# EAGLE design reload (EAGLE 6.2)
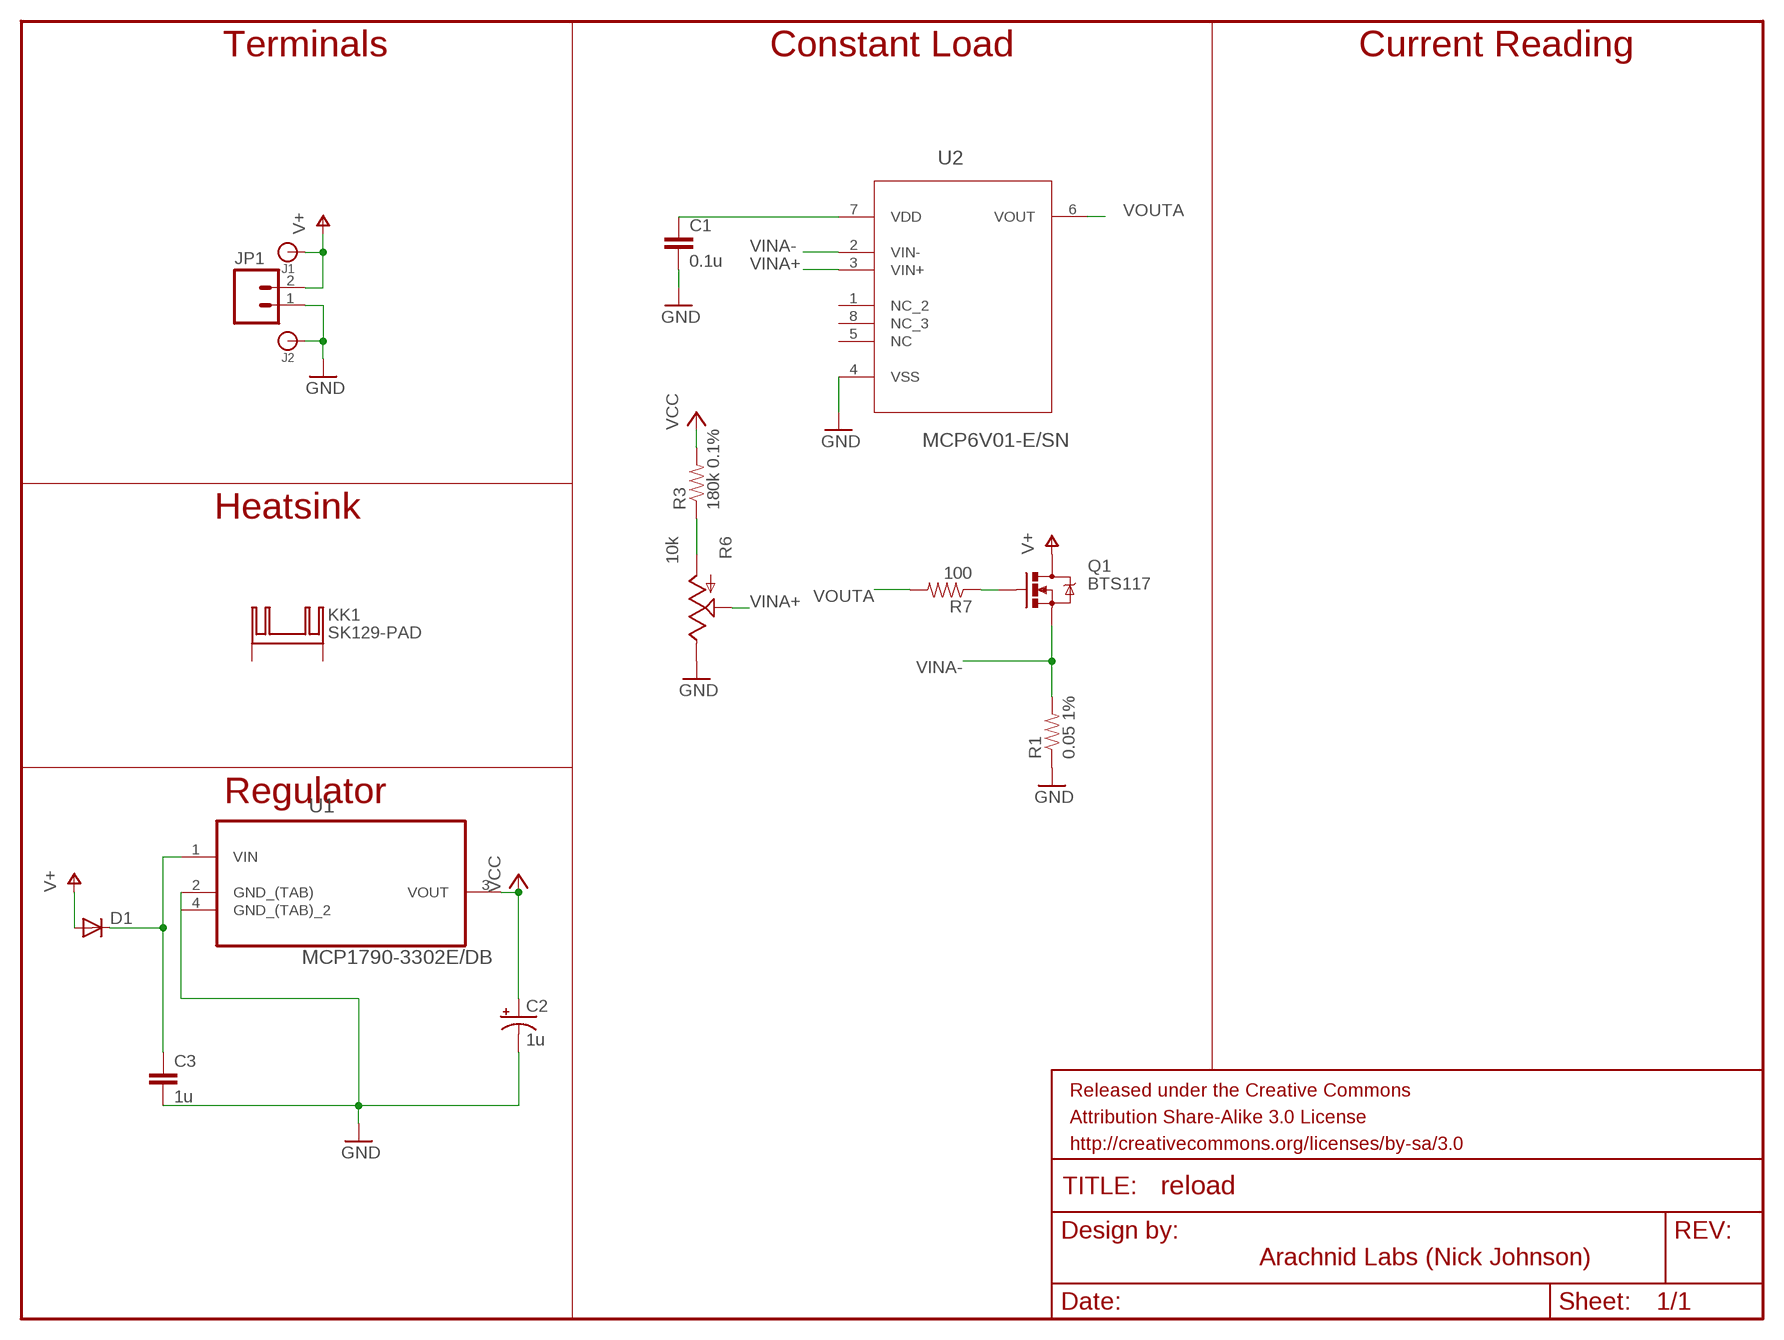
[diagram p0: schematic, sheet 1]

## Parts
C1  0.1u  CAPPTH  [CAP-PTH-SMALL]
C2  1u  CAP_POLPTH2  [CPOL-RADIAL-10UF-25V]
C3  1u  CAPPTH1  [CAP-PTH-5MM]
D1  DIODE1N4148  [DIODE-1N4148]
J1  BANANA_CONN  [BANANA_CONN]
J2  BANANA_CONN  [BANANA_CONN]
JP1  M02  [SPRINGTERMINAL-5MM-2]
KK1  SK129-PAD  [SK129]
Q1  BTS117  MOSFET-NCHANNELPTH2  [TO220V]
R1  0.05 1%  RESISTORPTH-1W  [AXIAL-0.6]
R3  180k 0.1%  RESISTORAXIAL-0.3  [AXIAL-0.3]
R6  10k  POT  [ALPS_POT]
R7  100  RESISTORAXIAL-0.3  [AXIAL-0.3]
U1  MCP1790-3302E/DB  [SOT230P700X180-4N]
U2  MCP6V01-E/SN  [SOIC127P600X175-8N]

## Nets
GND: C1.2 C2.2(-) C3.2 J2.P$1 JP1.1 R1.P$1 R6.P$1(E) U1.2(GND_(TAB)) U1.4(GND_(TAB)_2) U2.4(VSS)
N$2: R3.P$1 R6.P$3(A)
N$3: C1.1 U2.7(VDD)
N$8: C3.1 D1.C U1.1(VIN)
N$9: Q1.1(G) R7.P$1
V+: D1.A J1.P$1 JP1.2 Q1.2(D)
VCC: C2.1(+) R3.P$2
VINA+: R6.P$2(S) U2.3(VIN+)
VINA-: Q1.3(S) R1.P$2 U2.2(VIN-)
VOUTA: R7.P$2 U2.6(VOUT)
Unconnected: KK1.A2,5(K) KK1.B2,5(K) U1.3(VOUT) U2.1(NC_2) U2.5(NC) U2.8(NC_3)

## Notes on the sheet
- Terminals | Constant Load | Current Reading
- Heatsink
- Regulator
- Arachnid Labs (Nick Johnson)

## Library data of the parts
C1 C3 = SparkFun-Passives:CAP: Capacitor Standard 0603 ceramic capacitor, and 0.1" leaded capacitor.
C2 = SparkFun-Passives:CAP_POL: Capacitor Polarized These are standard SMD and PTH capacitors. Normally 10uF, 47uF, and 100uF in electrolytic and tantalum varieties. Always verify the external diameter of the through hole cap, it varies with capacity, voltage, and manufacturer. The EIA devices should be standard.
D1 = SparkFun-DiscreteSemi:DIODE: Diode These are standard reverse protection diodes and small signal diodes. SMA package can handle up to about 1A. SOD-323 can handle about 200mA. What the SOD-323 package when ordering, there are some mfgs out there that are 5-pin packages.
J1 J2 = SparkFun-Connectors:BANANA_CONN: Through-hole banana jack
JP1 = nickparts:M02: Header 2 Standard 2-pin 0.1" header. Use with straight break away headers (SKU : PRT-00116), right angle break away headers (PRT-00553), swiss pins (PRT-00743), machine pins (PRT-00117), and female headers (PRT-00115). Molex polarized connector foot print use with SKU : PRT-08233 with associated crimp pins and housings.
KK1 = nickparts:SK129-PAD: HEATSINK manufacturer Fischer/distributor Buerklin
Q1 = SparkFun-DiscreteSemi:MOSFET-NCHANNEL: Generic NMOS footprint
R1 R3 R7 = SparkFun-Passives:RESISTOR: Resistor Basic schematic elements and footprints for 0603, 1206, and PTH resistors.
R6 = nickparts:POT
U1 = Microchip_By_element14_Batch_1:MCP1790-3302E/DB: IC, LDO VOLT REG, 3.3V, 70mA; MPN: MCP1790-3302E/DB; OC_FARNELL: 1675422; OC_NEWARK: 40M0645; PACKAGE: SOT-223-3; SUPPLIER: Microchip
U2 = Microchip_By_element14_Batch_1:MCP6V01-E/SN: Auto-Zeroed Op Amps; MPN: MCP6V01-E/SN; OC_FARNELL: 1629346; OC_NEWARK: 27M0220; PACKAGE: SOIC-8; SUPPLIER: Microchip

## Board
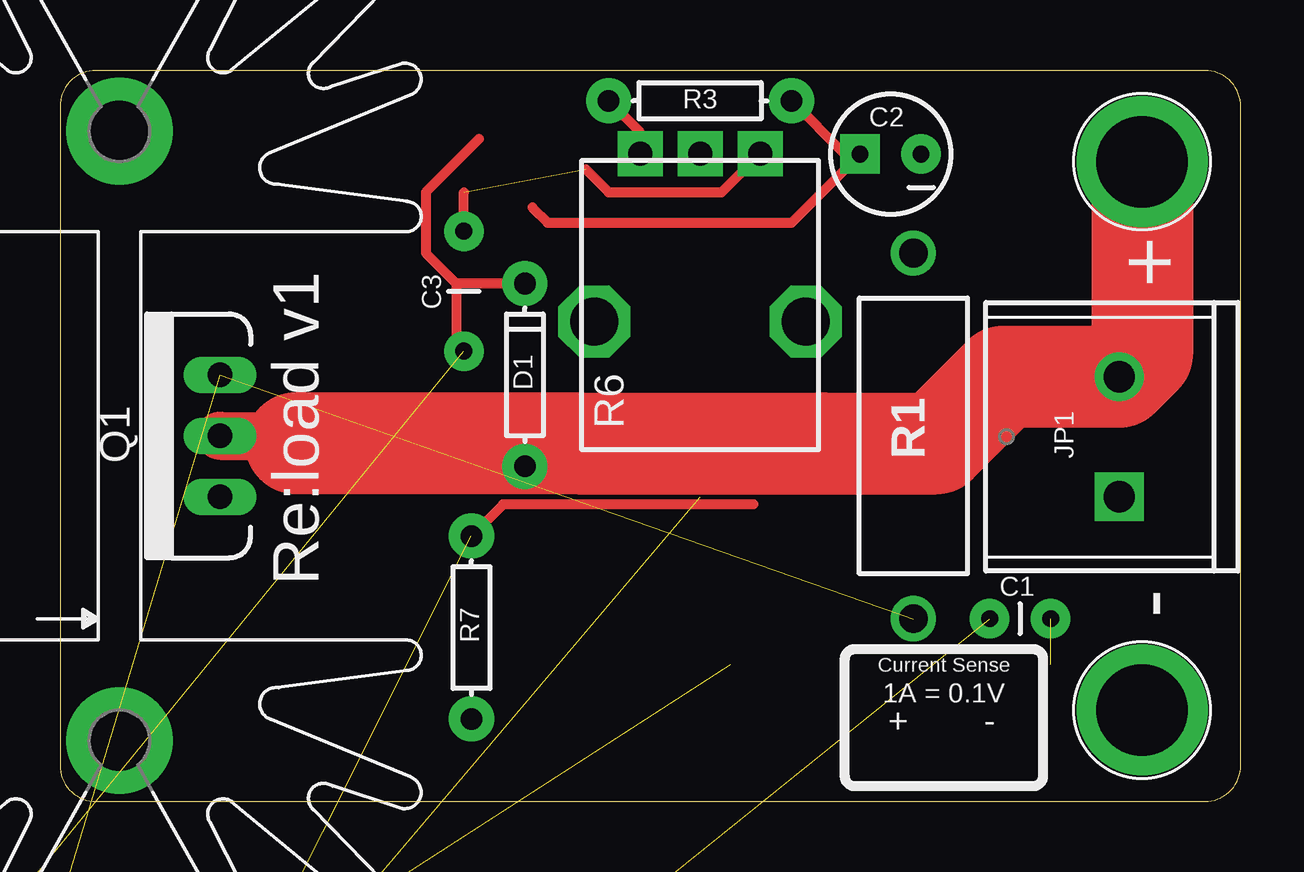
[diagram p1: board, top side]
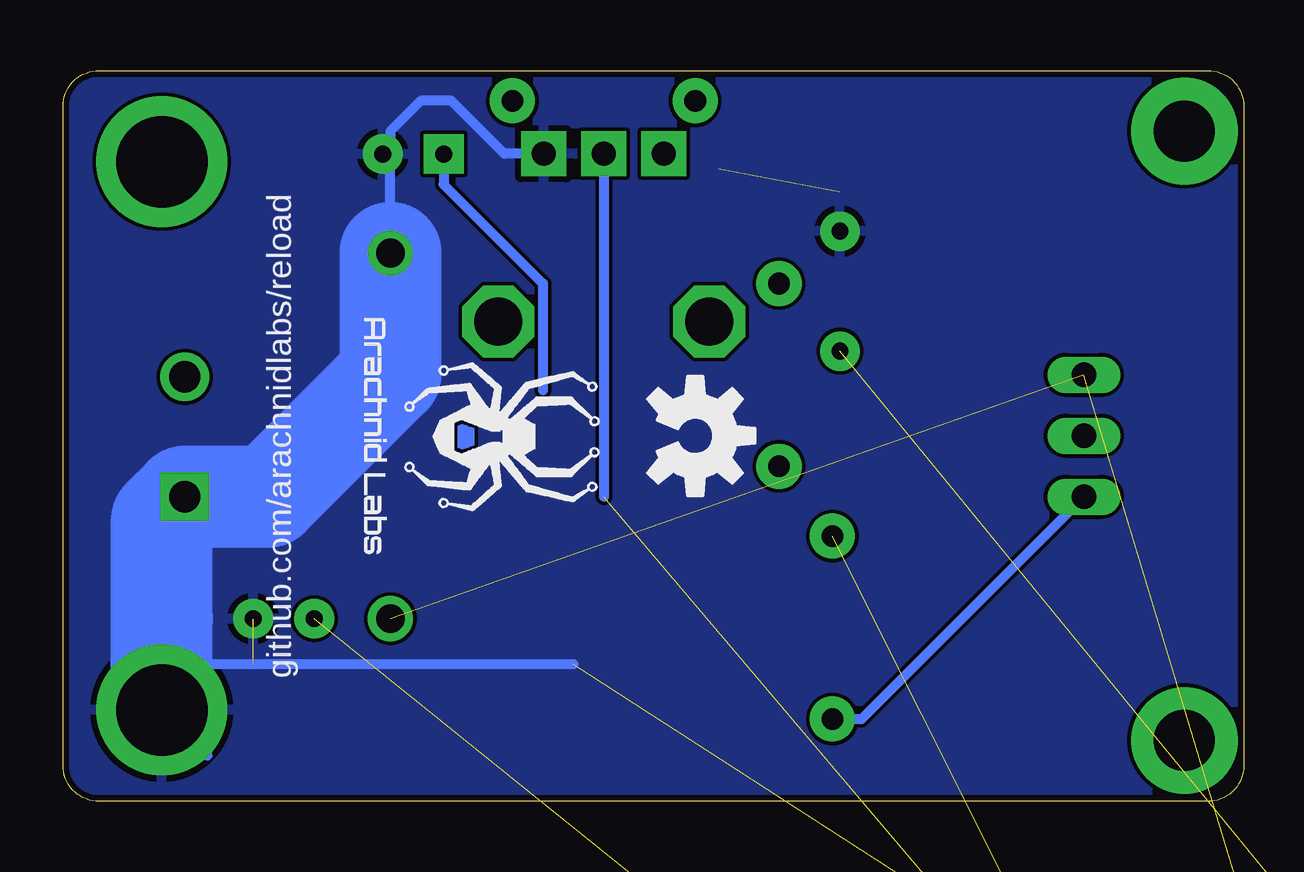
[diagram p2: board, bottom side, seen from below]

Size 49.2 x 30.47 mm. Coordinates in mm from the lower left corner, seen from the top.
Outline: 0,28.97 0,1.5 arc90 1.5,0 47.7,0 arc90 49.2,1.5 49.2,28.97 arc90 47.7,30.47 1.5,30.47 arc90 0,28.97
Copper layers (1*16): Top 0.035mm / dielectric 1.5mm / Bottom 0.035mm
Design rules: minimum track width 6mil, minimum drill 0.3mm, track to track 6mil, track to pad 6mil, pad to pad 6mil, via to via 6mil, smd to smd 0mil, copper to edge 10mil, drill to drill 10mil, minimum pad ring 10mil, minimum via ring 6mil, stop-mask expansion 2mil, vias tented up to drill 100mil, thermal gap 10mil

### Footprints (pad centres in the part's own frame; a part is rotated, then mirrored left to right if it is on the bottom)
CAP-PTH-SMALL = drill 0.7 pad 1.651: 1 0,0; 2 2.54,0
CPOL-RADIAL-10UF-25V = drill 0.7 pad 1.651 square: 1 1.27,0 | drill 0.7 pad 1.651: 2 -1.27,0
CAP-PTH-5MM = drill 0.7 pad 1.651: 1 -2.5,0; 2 2.5,0
DIODE-1N4148 = drill 0.9 pad 1.88: A -3.81,0; C 3.81,0
BANANA_CONN = drill 3.81 pad 5.461: P$1 0,0
SPRINGTERMINAL-5MM-2 = drill 1.3 pad 2.032 square: 1 0,0 | drill 1.3 pad 2.032: 2 5,0
SK129 = drill 2.54 pad 4.445: A2,5 -12.7,-0.889; B2,5 12.7,-0.889
TO220V = drill 1.016 long: 1 -2.54,0; 2 0,0; 3 2.54,0
AXIAL-0.6 = drill 1.2 pad 1.88: P$1 -7.62,0; P$2 7.62,0
AXIAL-0.3 = drill 0.9 pad 1.88: P$1 -3.81,0; P$2 3.81,0
ALPS_POT = drill 1 pad 1.88 square: P$1 7,-2.5; P$2 7,0; P$3 7,2.5 | drill 2 octagon: P$4 0,-4.4; P$5 0,4.4
SOT230P700X180-4N = smd 1.626 x 0.889: 1 -3.2,2.311; 2 -3.2,0; 3 -3.2,-2.311 | smd 1.626 x 3.175: 4 3.2,0
SOIC127P600X175-8N = smd 1.981 x 0.559: 1 -2.362,1.905; 2 -2.362,0.635; 3 -2.362,-0.635; 4 -2.362,-1.905; 5 2.362,-1.905; 6 2.362,-0.635; 7 2.362,0.635; 8 2.362,1.905

### Placement (x,y rotation side)
C1  38.73,7.62 0 top
C2  34.61,26.99 180 top
C3  16.83,21.27 90 top
D1  19.37,17.78 90 top
J1  45.09,26.67 0 top
J2  45.09,3.81 0 top
JP1  44.13,12.7 90 top
KK1  1.59,15.24 90 top
Q1  6.67,15.24 90 top
R1  35.56,15.24 270 top
R3  26.67,29.21 0 top
R6  26.67,20 90 top
R7  17.14,7.25 90 top
U1  -3.81,-12.7 0 top  (outside the outline)
U2  -3.81,-25.4 0 top  (outside the outline)
U$2  [ARACHNID_LABS_LOGO_SM]  31.75,15.24 270 bottom
U$3  [OSHW-LOGO-M]  22.86,15.24 270 bottom

### Tracks (layer width: path | path; a pad name or v marks a point on that pad's centre or on a via)
GND  (5 unrouted)
  Top 0.406: 21.91,26.35 22.86,25.4 27.57,25.4 R6.P$1 | C3.2 16.83,25.4
  Bottom 0.406: 43.18,1.91 J2.P$1 | R1.P$1 35.56,26.67 C2.2 35.56,27.3 35.56,27.94 34.29,29.21 33.02,29.21 30.81,27 R6.P$1 | 27.94,5.71 39.37,5.71 41.27,5.71 43.18,5.71 45.09,7.62
  Bottom 4.242: J2.P$1 45.09,7.62 45.09,11.75 JP1.1 40.64,12.7 35.56,17.78 R1.P$1
  pour Bottom: 0,30.48 49.12,30.48 arc-90 49.53,30.07 49.53,0 0.41,0 arc-90 0,0.41
N$2
  Top 0.406: R6.P$3 24.17,27.9 R3.P$1
N$3  (1 unrouted)
N$8  (1 unrouted)
  Top 0.406: 17.46,27.62 15.24,25.4 15.24,22.86 16.51,21.59 | 16.51,21.59 16.51,19.09 C3.1 | D1.C 16.51,21.59
N$9
  Bottom 0.406: R7.P$1 15.93,3.44 Q1.1
V+
  Top 0.406: 32.07,14.61 31.75,14.92 | 13.97,15.24 13.97,14.92
  Top 2: Q1.2 10.66,15.24 arc-45 11.43,14.92 13.2,14.92 arc45 13.97,15.24 | D1.A 21.89,15.88 arc45 20.83,15.44 20.32,14.92
  Top 4.242: 9.84,14.92 11.43,14.92 20.32,14.92 21.59,14.92 31.75,14.92 36.51,14.92 39.29,17.7 JP1.2 45.09,18.65 J1.P$1
VCC
  Top 0.406: R3.P$2 32.7,26.99 C2.1 30.48,24.13 20.32,24.13 19.68,24.77
  Bottom 0.406: C2.1 33.34,25.72 29.21,21.59 29.21,17.14
VINA+  (1 unrouted)
  Bottom 0.406: R6.P$2 26.67,12.7
VINA-  (2 unrouted)
VOUTA  (1 unrouted)
  Top 0.406: 28.89,12.38 18.47,12.38 R7.P$2

### Text on the board
tNames: + | Re:load v1 | - | Current Sense | 1A = 0.1V | + | -
bNames: github.com/arachnidlabs/reload